# EAGLE design 14145 (EAGLE 7.6.0)
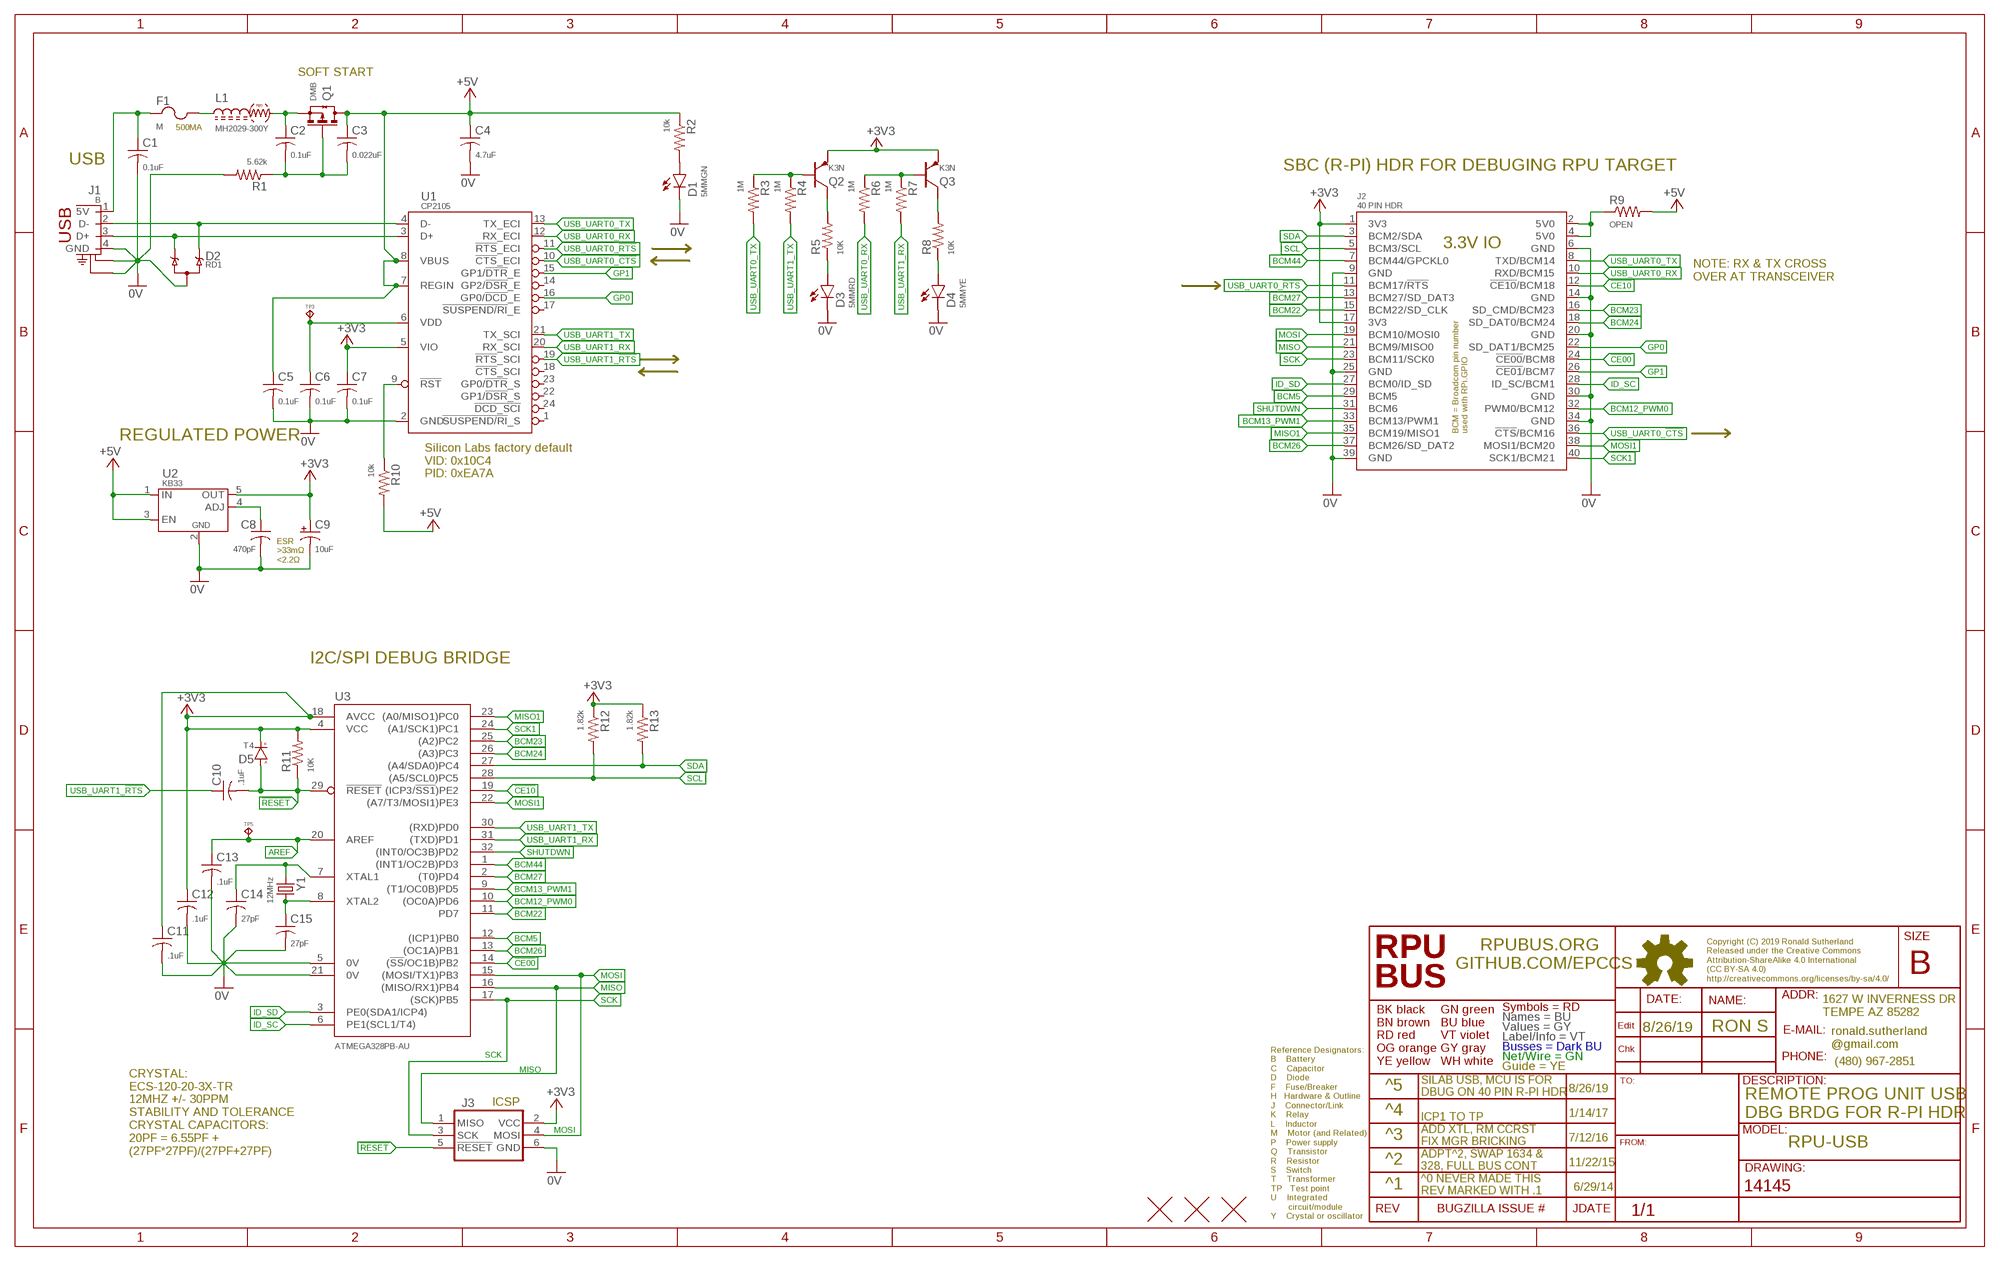
[diagram p0: schematic, sheet 1]

## Parts
C1  0.1uF  CC0603A  [C0603(1608)]
C2  0.1uF  CC0603A  [C0603(1608)]
C3  0.022uF  CC0603A  [C0603(1608)]
C4  4.7uF  CC1206  [C1206(3216)]
C5  0.1uF  CC0603A  [C0603(1608)]
C6  0.1uF  CC0603A  [C0603(1608)]
C7  0.1uF  CC0603A  [C0603(1608)]
C8  470pF  CC0603A  [C0603(1608)]
C9  10uF  CT1206  [3216]
C10  .1uF  CC0603A  [C0603(1608)]
C11  .1uF  CC0603A  [C0603(1608)]
C12  .1uF  CC0603A  [C0603(1608)]
C13  .1uF  CC0603A  [C0603(1608)]
C14  27pF  CC0603A  [C0603(1608)]
C15  27pF  CC0603A  [C0603(1608)]
D1  5MMGN  LED5MM  [LED5MM]
D2  RD1  TVS-2UNI  [SOT23]
D3  5MMRD  LED5MM  [LED5MM]
D4  5MMYE  LED5MM  [LED5MM]
D5  T4  DSOD123  [SOD123]
F1  M  SMD1210  [C1210(3225)]
J1  B  [USB-B-PTH]
J2  40 PIN HDR  RPI-ZERO  [RASPI_ZERO_H40PIN]
J3  ISP-SPIPTH  [ISP]
L1  MH2029-300Y  L0805  [C0805(2012)]
Q1  DMB  N-CHSOT23  [SOT23]
Q2  K3N  PNPSOT23  [SOT23]
Q3  K3N  PNPSOT23  [SOT23]
R1  5.62k  R0805  [C0805(2012)]
R2  10k  R0805  [C0805(2012)]
R3  1M  R0805  [C0805(2012)]
R4  1M  R0805  [C0805(2012)]
R5  10K  R0805  [C0805(2012)]
R6  1M  R0805  [C0805(2012)]
R7  1M  R0805  [C0805(2012)]
R8  10K  R0805  [C0805(2012)]
R9  OPEN  R0805  [C0805(2012)]
R10  10k  R0805  [C0805(2012)]
R11  10K  R0805  [C0805(2012)]
R12  1.82k  R0805  [C0805(2012)]
R13  1.82k  R0805  [C0805(2012)]
TP3  TPPAD1-08  [P1-08]
TP5  TPPAD1-08  [P1-08]
U1  CP2105  [QFN24]
U2  KB33  MIC5205  [SOT23-5,SOT25]
U3  ATMEGA328PB-AU  [TQFP32-08]
U$2  FIDUCIAL1.27  [FIDUCIAL-1.27]
U$3  FIDUCIAL1.27  [FIDUCIAL-1.27]
U$4  FIDUCIAL1.27  [FIDUCIAL-1.27]
Y1  12MHz  CSM-3X  [CSM-3X]

## Nets
0V: C1.2 C4.2 C5.2 C6.2 C7.2 C8.2 C9.- C11.2 C12.2 C13.2 C14.2 C15.2 D1.K D2.3(A) D3.K D4.K J1.4(GND) J1.S1(CHASSIS1) J1.S2(CHASSIS2) J2.6(GND) J2.9(GND) J2.14(GND) J2.20(GND) J2.25(GND) J2.30(GND) J2.34(GND) J2.39(GND) J3.6(GND) R1.2 U1.2(GND) U2.2(GND) U3.5(0V) U3.21(0V)
5V0@2: J2.2(5V0) J2.4(5V0) R9.1
!CE00!: J2.24(!CE00!/BCM8) U3.14((!SS!/OC1B)PB2)
!CE10!: J2.12(!CE10!/BCM18) U3.19((ICP3/!SS1!)PE2)
!RESET: C10.2 D5.A J3.5(!RESET) R11.1 U3.29(!RESET)
+3V3: C7.1 C9.+ C11.1 C12.1 D5.C(K) J2.1(3V3) J2.17(3V3) J3.2(VCC) Q2.E Q3.E R11.2 R12.1 R13.1 U1.5(VIO) U2.5(OUT) U3.4(VCC) U3.18(AVCC)
+5V: C3.1 C4.1 C5.1 Q1.3(D)(D) R2.1 R9.2 R10.2 U1.7(REGIN) U1.8(VBUS) U2.1(IN) U2.3(EN)
AREF: C13.1 TP5.TP U3.20(AREF)
BCM5: J2.29(BCM5) U3.12((ICP1)PB0)
BCM12_PWM0: J2.32(PWM0/BCM12) U3.10((OC0A)PD6)
BCM13_PWM1: J2.33(BCM13/PWM1) U3.9((T1/OC0B)PD5)
BCM22: J2.15(BCM22/SD_CLK) U3.11(PD7)
BCM23: J2.16(SD_CMD/BCM23) U3.25((A2)PC2)
BCM24: J2.18(SD_DAT0/BCM24) U3.26((A3)PC3)
BCM26: J2.37(BCM26/SD_DAT2) U3.13((OC1A)PB1)
BCM27: J2.13(BCM27/SD_DAT3) U3.2((T0)PD4)
BCM44: J2.7(BCM44/GPCKL0) U3.1((INT1/OC2B)PD3)
D+: D2.1(C1) J1.3(D+) U1.3(D+)
D-: D2.2(C2) J1.2(D-) U1.4(D-)
FTDI3V3: C6.1 TP3.TP U1.6(VDD)
GP0: J2.22(SD_DAT1/BCM25) U1.16(GP0/!DCD!_E)
GP1: J2.26(!CE01!/BCM7) U1.15(GP1/!DTR!_E)
ID_SC: J2.28(ID_SC/BCM1) U3.6(PE1(SCL1/T4))
ID_SD: J2.27(BCM0/ID_SD) U3.3(PE0(SDA1/ICP4))
MISO: J2.21(BCM9/MISO0) J3.1(MISO) U3.16((MISO/RX1)PB4)
MISO1: J2.35(BCM19/MISO1) U3.23((A0/MISO1)PC0)
MOSI: J2.19(BCM10/MOSI0) J3.4(MOSI) U3.15((MOSI/TX1)PB3)
MOSI1: J2.38(MOSI1/BCM20) U3.22((A7/T3/MOSI1)PE3)
N$1: D1.A R2.2
N$2: D4.A R8.1
N$3: Q3.C R8.2
N$4: C1.1 F1.1 J1.1(5V)
N$5: F1.2 L1.1
N$6: D3.A R5.1
N$7: R10.1 U1.9(!RST!)
N$8: Q2.C R5.2
N$9: Q2.B R3.1 R4.1
N$17: Q3.B R6.1 R7.1
N$24: C8.1 U2.4(ADJ)
N$26: C2.1 L1.2 Q1.2(S)(S)
N$27: C2.2 C3.2 Q1.1(G)(G) R1.1
SCK: J2.23(BCM11/SCK0) J3.3(SCK) U3.17((SCK)PB5)
SCK1: J2.40(SCK1/BCM21) U3.24((A1/SCK1)PC1)
SCL: J2.5(BCM3/SCL) R12.2 U3.28((A5/SCL0)PC5)
SDA: J2.3(BCM2/SDA) R13.2 U3.27((A4/SDA0)PC4)
SHUTDWN: J2.31(BCM6) U3.32((INT0/OC3B)PD2)
USB_UART0_!CTS: J2.36(!CTS!/BCM16) U1.10(!CTS!_ECI)
USB_UART0_!RTS: J2.11(BCM17/!RTS!) U1.11(!RTS!_ECI)
USB_UART0_RX: J2.10(RXD/BCM15) R6.2 U1.12(RX_ECI)
USB_UART0_TX: J2.8(TXD/BCM14) R3.2 U1.13(TX_ECI)
USB_UART1_!RTS: C10.1 U1.19(!RTS!_SCI)
USB_UART1_RX: R7.2 U1.20(RX_SCI) U3.31((TXD)PD1)
USB_UART1_TX: R4.2 U1.21(TX_SCI) U3.30((RXD)PD0)
XTAL1: C14.1 U3.7(XTAL1) Y1.1
XTAL2: C15.1 U3.8(XTAL2) Y1.2
Unconnected: U1.1(!SUSPEND/RI!_S) U1.14(GP2/!DSR!_E) U1.17(!SUSPEND/RI!_E) U1.18(!CTS!_SCI) U1.22(GP1/!DSR!_S) U1.23(GP0/!DTR!_S) U1.24(!DCD_SCI!)

## Notes on the sheet
- SOFT START
- 500MA
- USB
- SBC (R-PI) HDR FOR DEBUGING RPU TARGET
- NOTE: RX & TX CROSS
  OVER AT TRANSCEIVER
- REGULATED POWER
- Silicon Labs factory default
  VID: 0x10C4
  PID: 0xEA7A
- ESR
  >33mΩ
  <2.2Ω
- I2C/SPI DEBUG BRIDGE
- 8/26/19 | RON S
- ^5 | 8/26/19
- SILAB USB, MCU IS FOR
  DBUG ON 40 PIN R-PI HDR
- ICSP
- ^4 | 1/14/17
- REMOTE PROG UNIT USB 
  DBG BRDG FOR R-PI HDR
- ICP1 TO TP
- ^3 | 7/12/16
- ADD XTL, RM CCRST
  FIX MGR BRICKING
- RPU-USB
- CRYSTAL:
  ECS-120-20-3X-TR 
  12MHZ +/- 30PPM
  STABILITY AND TOLERANCE
  CRYSTAL CAPACITORS:
  20PF = 6.55PF +
  (27PF*27PF)/(27PF+27PF)
- ^2 | 11/22/15
- ADPT^2, SWAP 1634 &
  328, FULL BUS CONT
- ^1 | 6/29/14
- ^0 NEVER MADE THIS
  REV MARKED WITH .1

## Library data of the parts
C1-C8 C10-C15 = C-C:C: CAPACITOR Symbol
C9 = C-T:CT: Tantalum Electrolytic Capacitor
D1 D3 D4 = D-LED:LED: LED 120120WH [CREE,XHGAWT-00-0000-00000HXE1] LED WHITE 6500K 150LUM-W120120
D2 = D-TVS:TVS-2UNI: 2 Unidirectional Channels e.g., DESDA5V3L [DIODES@DESDA5V3L-7] TVS DIODE 3V 15V SOT23 MARK: RD1
D5 = D-GP:D: DIODE
F1 = F-RST:SMD: Fuse i.e. Bourns, MF-USMF075-2
J1 = J-USB:B: B [MOLEX,0670688000] USB B THROUGH HOLE
J2 = U-Pi:RPI-ZERO: Raspberry Pi Zero https://pinout.xyz/ NOTE: WiFi is needed see https://www.kickstarter.com/projects/1991736672/iot-hat-for-raspberry-pi-a-must-have-for-pi-zero
J3 = U-AVR:ISP-SPI: AVR ISP thru SPI In-System Programming uses the target Atmel AVR’s internal SPI (Serial Peripheral Interface) to download code into the flash and EEPROM memories. It is not a debugging interface. When designing an application PCB which includes an AVR with the SPI interface, this pinout should be used. Sparkfun SKU: BOB-08508
L1 = L-FB:L: Ferrite Bead with frequency dependent resistance
Q1 = Q-PCH:N-CH?*: ENHANCEMENT MODE MOSFET SOT23 is BSS138 pinout
Q2 Q3 = Q-PNP:PNP: BJT NPN General Purpose Amplifier
R1-R13 = R-C:R: Resiistor American-style symbol
TP3 TP5 = J-TP:TP: Test pad
U1 = U-Transceiver:CP2105: CP2105 SILABS@CP2105-F01-GMR TRANSCEIVER USB DUAL UART 24QFN
U2 = P-DCDC:MIC5205: KB33 [MICREL,MIC5205-3.3YM5] REG ULDO 3V3 150MA SOT23-5
U3 = U-AVR:ATMEGA328PB-AU: ATmega328PB 4 Kbytes FLASH 128 bytes SRAM 256 bytes EEPROM 2 UART, 2 I2C, 2 SPI 8-channel 10 bit ADC
U$2-U$4 = H-Fiducial:FIDUCIAL: Fiducial Alignment Points Various fiducial points for machine vision alignment.
Y1 = Y-XTL:CSM: 16MHZ20 [ECS,ECS-160-20-3X-TR] CRYSTAL 16MHZ 20PF 30PPM CSM-3X

## Net classes
0 default: width 0.178 mm, drill 0.33 mm

## Board
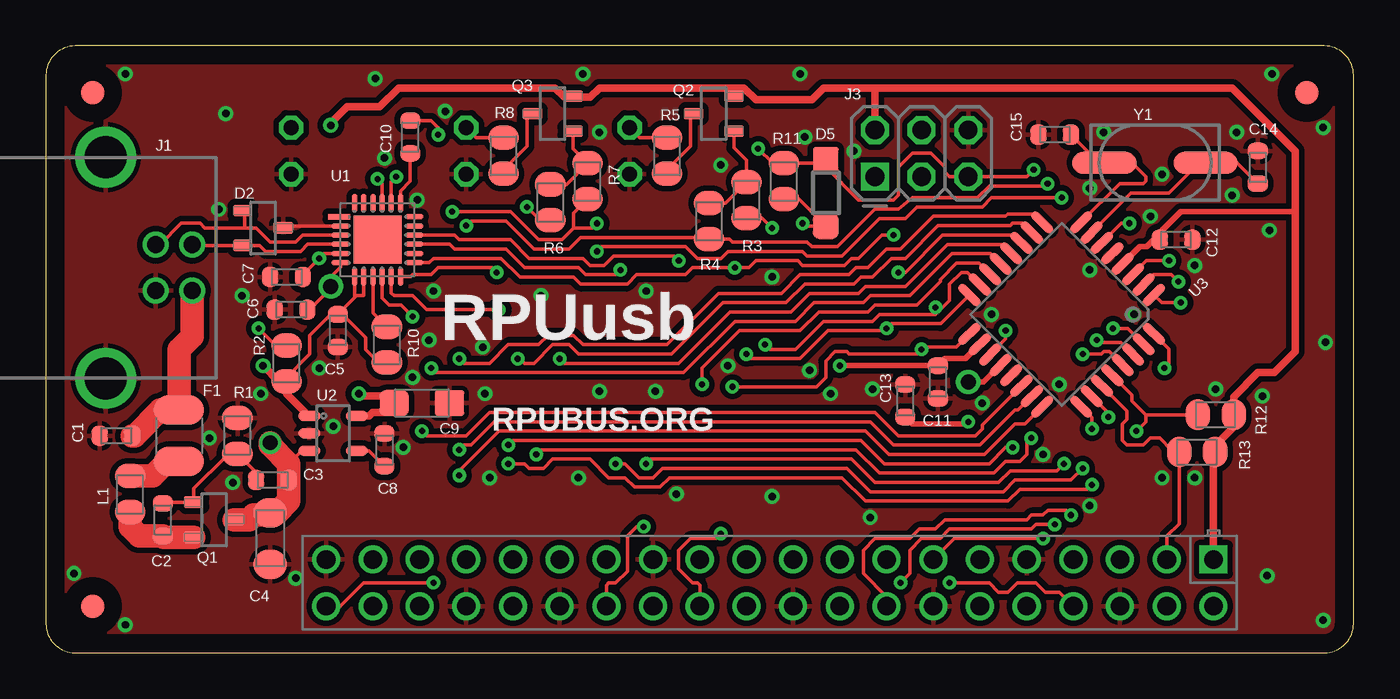
[diagram p1: board, top side]
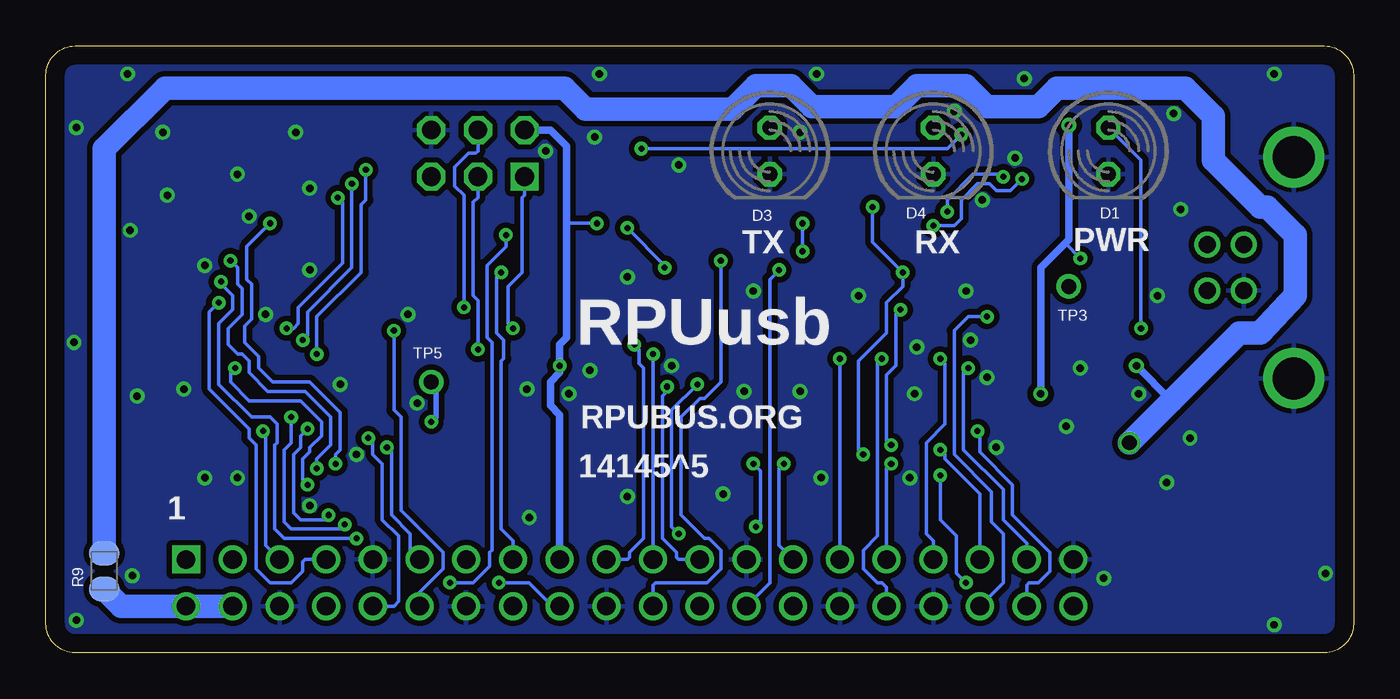
[diagram p2: board, bottom side, seen from below]

Size 71.12 x 33.02 mm. Coordinates in mm from the lower left corner, seen from the top.
Outline: 0,31.43 0,1.59 arc90 1.59,0 69.53,0 arc90 71.12,1.59 71.12,31.43 arc90 69.53,33.02 1.59,33.02 arc90 0,31.43
Copper layers (1*16): Top 0.034290625mm / dielectric 60mil / Bottom 0.034290625mm
Design rules "default *": minimum track width 8mil, minimum drill 13mil, track to track 8mil, track to pad 8mil, pad to pad 7mil, via to via 8mil, smd to smd 7mil, copper to edge 40mil, drill to drill 12mil, minimum pad ring 10mil, minimum via ring 8mil, stop-mask expansion 4mil, vias tented up to drill 17mil, thermal gap 10mil

### Footprints (pad centres in the part's own frame; a part is rotated, then mirrored left to right if it is on the bottom)
C0603(1608) = smd 0.898 x 1.1: 1 -0.889,0; 2 0.889,0
C1206(3216) = smd 1.6 x 1.8: 1 -1.4,0; 2 1.4,0
3216 = smd 1.6 x 1.4: + -1.5,0; - 1.5,0
LED5MM = drill 0.813 octagon: A -1.27,0; K 1.27,0
SOT23 = smd 0.65 x 1.06: 1 -0.95,-1.1; 2 0.95,-1.1; 3 0,1.1
SOD123 = smd 1.4 x 1.4: A 1.8,0; C -1.8,0
C1210(3225) = smd 1.6 x 2.7: 1 -1.4,0; 2 1.4,0
USB-B-PTH = drill 0.914: 1 1.981,-1.25; 2 1.981,1.25; 3 0,1.25; 4 0,-1.25 | drill 2.286: S1 -2.718,-6.02; S2 -2.718,6.02
RASPI_ZERO_H40PIN = drill 1.016 square: 1 0,0 | drill 1.016: 2 0,2.54; 3 2.54,0; 4 2.54,2.54; 5 5.08,0; 6 5.08,2.54; 7 7.62,0; 8 7.62,2.54; 9 10.16,0; 10 10.16,2.54; 11 12.7,0; 12 12.7,2.54; 13 15.24,0; 14 15.24,2.54; 15 17.78,0; 16 17.78,2.54; 17 20.32,0; 18 20.32,2.54; 19 22.86,0; 20 22.86,2.54; 21 25.4,0; 22 25.4,2.54; 23 27.94,0; 24 27.94,2.54; 25 30.48,0; 26 30.48,2.54; 27 33.02,0; 28 33.02,2.54; 29 35.56,0; 30 35.56,2.54; 31 38.1,0; 32 38.1,2.54; 33 40.64,0; 34 40.64,2.54; 35 43.18,0; 36 43.18,2.54; 37 45.72,0; 38 45.72,2.54; 39 48.26,0; 40 48.26,2.54
ISP = drill 1.016 square: 1 0,0 | drill 1.016 octagon: 2 0,2.54; 3 2.54,0; 4 2.54,2.54; 5 5.08,0; 6 5.08,2.54
C0805(2012) = smd 1.321 x 1.651: 1 -0.977,0; 2 0.977,0
SOT23' = smd 0.65 x 1.06: 1(G) -0.95,-1.1; 2(S) 0.95,-1.1; 3(D) 0,1.1
SOT23'' = smd 0.65 x 1.06: B -0.95,-1.1; C 0,1.1; E 0.95,-1.1
P1-08 = drill 0.813: TP 0,0
QFN24 = smd 1.2 x 0.3: 1 -2.1,1.25 | smd 1 x 0.3: 2 -2,0.75; 3 -2,0.25; 4 -2,-0.25; 5 -2,-0.75; 6 -2,-1.25; 13 2,-1.25; 14 2,-0.75; 15 2,-0.25; 16 2,0.25; 17 2,0.75; 18 2,1.25 | smd 0.3 x 1: 7 -1.25,-2; 8 -0.75,-2; 9 -0.25,-2; 10 0.25,-2; 11 0.75,-2; 12 1.25,-2; 19 1.25,2; 20 0.75,2; 21 0.25,2; 22 -0.25,2; 23 -0.75,2; 24 -1.25,2 | smd 2.6 x 2.6: EXP 0,0
SOT23-5,SOT25 = smd 0.55 x 1.2: 1 -0.95,-1.3; 2 0,-1.3; 3 0.95,-1.3; 4 0.95,1.3; 5 -0.95,1.3
TQFP32-08 = smd 1.5 x 0.45: 1 -4.293,2.8; 2 -4.293,2; 3 -4.293,1.2; 4 -4.293,0.4; 5 -4.293,-0.4; 6 -4.293,-1.2; 7 -4.293,-2; 8 -4.293,-2.8; 17 4.293,-2.8; 18 4.293,-2; 19 4.293,-1.2; 20 4.293,-0.4; 21 4.293,0.4; 22 4.293,1.2; 23 4.293,2; 24 4.293,2.8 | smd 0.45 x 1.5: 9 -2.8,-4.293; 10 -2,-4.293; 11 -1.2,-4.293; 12 -0.4,-4.293; 13 0.4,-4.293; 14 1.2,-4.293; 15 2,-4.293; 16 2.8,-4.293; 25 2.8,4.293; 26 2,4.293; 27 1.2,4.293; 28 0.4,4.293; 29 -0.4,4.293; 30 -1.2,4.293; 31 -2,4.293; 32 -2.8,4.293
FIDUCIAL-1.27 = smd 1.27 x 1.27: 1 0,0
CSM-3X = smd 3.5 x 1.2: 1 -2.75,0; 2 2.75,0

### Placement (x,y rotation side)
C1  3.81,11.81 180 top
C2  6.35,7.24 90 top
C3  12.32,9.4 180 top
C4  12.19,6.22 270 top
C5  15.88,17.53 270 top
C6  13.34,18.67 180 top
C7  13.08,20.45 180 top
C8  18.41,11.05 90 top
C9  20.45,13.59 0 top
C10  19.81,28.07 90 top
C11  48.51,14.73 270 top
C12  61.47,22.48 0 top
C13  46.74,13.72 90 top
C14  65.91,26.42 90 top
C15  54.86,28.19 180 top
D1  13.34,27.3 270 bottom
D2  11.81,23.11 270 top
D3  31.75,27.3 270 bottom
D4  22.86,27.3 270 bottom
D5  42.42,25.02 90 top
F1  7.24,11.81 270 top
J1  5.97,20.95 0 top
J2  63.5,5.08 180 top
J3  45.09,25.91 0 top
L1  4.57,8.64 270 top
Q1  DMB  [SOT23']  9.14,7.24 270 top
Q2  K3N  [SOT23'']  36.32,29.34 90 top
Q3  K3N  [SOT23'']  27.56,29.34 90 top
R1  10.41,11.81 90 top
R2  13.08,15.75 90 top
R3  38.1,24.64 270 top
R4  36.07,23.5 270 top
R5  33.78,27.05 270 top
R6  27.43,24.51 270 top
R7  29.46,25.65 270 top
R8  24.89,27.05 270 top
R9  67.94,4.45 90 bottom
R10  18.54,16.76 270 top
R11  40.13,25.65 270 top
R12  63.63,12.95 180 top
R13  62.61,10.92 180 top
TP3  15.49,19.94 180 bottom
TP5  50.16,14.73 0 bottom
U1  18.03,22.48 0 top
U2  15.62,11.94 270 top
U3  55.24,18.41 225 top
U$2  68.58,30.48 0 top
U$3  2.54,30.48 0 top
U$4  2.54,2.54 0 top
Y1  60.33,26.67 180 top

### Tracks (layer width: path | path; a pad name or v marks a point on that pad's centre or on a via)
0V  (via drill 0.41)
  Top 0.203: U1.2 13.03,23.23 D2.3
  other vias: 15.62,12.32 11.68,14.1 10.16,9.27 1.52,4.32 4.32,1.52 13.59,4.06 66.55,22.99 64.52,24.89 60.07,23.75 20.19,24.64 56.77,20.83 56.77,25.27 57.53,28.32 64.77,28.32 60.71,26.04 62.48,21.08 63.63,14.35 66.17,13.97 66.67,31.5 69.47,28.57 69.6,16.89 69.47,1.78 41.02,31.5 29.21,31.5 17.91,31.24 21.72,29.46 30.1,28.32 36.7,26.54 41.27,28.07 43.94,27.3 37.08,15.62 44.96,14.35 50.93,13.59 55.12,14.61 51.44,18.41 59.18,18.41 60.71,9.53 62.48,9.53 66.42,4.19 4.32,31.5 9.4,24.13 9.78,29.34 18.41,26.92 21.08,19.68 20.83,17.02 14.86,15.49 10.67,19.43 8.89,11.68 39.5,20.45 32.64,19.68 26.92,19.43 23.75,16.64 23.88,14.1 30.1,14.22 33.15,14.22 24.13,9.53 28.96,9.53 34.29,8.64 39.5,8.51 41.53,15.37 44.83,7.37 56.77,8 54.23,10.79 19.43,11.18 19.94,14.99 42.67,14.1
  pour Top (isolate 0.305): 71.12,0 0,0 0,33.02 71.12,33.02
  pour Bottom (isolate 0.305): 0,33.02 71.12,33.02 71.12,0 0,0
5V0@2
  Bottom 1.27: J2.4 J2.2 67.02,2.54 R9.1
!CE00!  (via drill 0.33)
  Top 0.203: U3.14 50.75,21.21 49.53,21.21 48.64,20.32 48.64,20.19 47.37,18.92 45.09,18.92 44.7,18.54 42.04,18.54 41.02,17.53 37.72,17.53 35.69,15.49 v35.69,14.61 | v36.7,6.48 36.45,6.22 35.05,6.22 34.42,5.59 34.42,4.57 35.18,3.81 35.43,3.81 35.56,3.68 J2.24
  Bottom 0.203: v35.69,14.61 37.08,13.21 37.08,6.86 v36.7,6.48
!CE10!  (via drill 0.33)
  Top 0.203: U3.19 52.2,17.06 v52.2,17.53
  Bottom 0.203: v52.2,17.53 52.2,13.21 51.82,12.83 51.82,7.75 49.53,5.46 49.53,4.57 50.8,3.3 J2.12
!RESET  (via drill 0.33)
  Top 0.203: v38.73,27.43 39.54,26.63 R11.1 42.23,26.63 D5.A 42.42,26.42 44.2,24.64 46.1,24.64 46.35,24.89 46.35,26.42 47.12,27.18 48.13,27.18 48.9,26.42 48.9,26.16 49.15,25.91 J3.5 53.34,25.91 v53.72,26.29 | v21.34,28.19 21.34,28.57 20.95,28.96 C10.2 | U3.29 57.84,16.38 57.53,16.38 57.4,16.26 v56.39,16.26
  Bottom 0.203: v38.73,27.43 22.1,27.43 v21.34,28.19 | v56.39,16.26 56.39,18.29 53.98,20.7 53.98,24.38 53.72,24.64 v53.72,26.29
+3V3  (via drill 0.33, 0.41)
  Top 0.203: U1.5 15.12,21.73 v14.86,21.46 14.1,20.7 C7.1 | C12.1 60.71,22.61 | R11.2 40.96,24.68 D5.C 41.3,23.22 v41.15,23.37 | Q2.E 37.42,30.31 37.85,30.73 | Q3.E 28.66,30.18 28.83,30.23
  Top 0.305: U3.4 59.49,22.1 59.88,22.1 60.26,22.48 C12.1 | 60.71,22.61 60.71,22.99 61.72,24 67.94,24 | v43.18,15.62 C11.1 48.9,16 50,16 U3.18
  Top 0.406: J2.1 63.5,10.83 R13.1 63.59,11.26 64.6,12.28 R12.1 64.6,13.93 65.91,15.24 66.8,15.24 67.94,16.38 67.94,24 67.94,27.3 64.52,30.73 45.09,30.73 | 45.09,30.73 42.29,30.73 41.66,30.1 38.61,30.1 37.97,30.73 37.85,30.73 30.1,30.73 29.59,30.23 28.83,30.23 28.19,30.23 27.69,30.73 19.18,30.73 18.16,29.72 16.38,29.72 15.49,28.83 v15.49,28.7 | v17.02,14.1 17.14,13.97 18.44,13.97 C9.+ 18.57,13.08 17.78,13.08 17.59,12.89 U2.5 | J3.2 45.09,30.73
  Bottom 0.203: v14.86,21.46 15.68,22.29 | v41.15,23.37 42.8,23.37
  Bottom 0.406: v15.49,28.7 15.49,22.48 15.68,22.29 17.02,20.95 v17.02,14.1 | J2.17 43.18,12.95 43.69,13.46 43.69,14.73 43.18,15.24 v43.18,15.62 43.18,16.76 42.8,17.14 42.8,23.37 42.8,27.56 43.69,28.45 J3.2
+5V  (via drill 0.41, 0.8)
  Top 0.203: U2.3 13.91,10.99 13.21,10.29 | R2.1 13.08,14.99 14.35,16.26 14.35,17.27 15.49,18.41 C5.1 | R10.2 18.16,15.75 17.4,16.51 17.4,17.14 16.13,18.41 C5.1 | U1.7 16.78,19.32 | 16.78,19.32 C5.1 | U1.8 17.28,19.44 17.27,19.43 16.89,19.43 16.78,19.32
  Top 0.406: v11.81,15.62 12.66,14.77 R2.1 13.08,14.1 14.29,12.89 U2.1
  Top 1.27: Q1.3(D) 11.05,7.24 11.3,7.49 12.06,7.49 C4.1 12.58,7.62 13.21,8.26 C3.1 13.21,10.29 12.19,11.3 v12.19,11.43
  Bottom 0.406: v11.81,15.62 9.91,13.72
  Bottom 1.27: R9.2 67.94,27.43 64.64,30.73 52.2,30.73 42.93,30.73 41.78,29.59 33.78,29.59 32.51,30.86 30.61,30.86 29.46,29.72 24.89,29.72 23.75,30.86 21.08,30.86 19.94,29.72 17.14,29.72 16.13,30.73 9.14,30.73 7.62,29.21 7.62,26.8 5.08,24.26 4.7,24.26 3.17,22.73 3.17,19.43 5.08,17.4 6.22,17.4 9.91,13.72 v12.19,11.43
AREF  (via drill 0.33)
  Top 0.305: U3.20 51,14.73 TP5.TP | v50.16,12.57 50.04,12.45 47.12,12.45 C13.1
  Bottom 0.305: TP5.TP 49.91,14.48 49.91,12.83 v50.16,12.57
BCM5  (via drill 0.33)
  Top 0.203: U3.12 52,22.23 49.02,22.23 46.74,19.94 44.58,19.94 44.2,19.56 41.53,19.56 40.51,18.54 37.21,18.54 34.42,15.75 28.19,15.75 v27.94,16
  Bottom 0.203: v27.94,16 J2.29
BCM12_PWM0  (via drill 0.33)
  Top 0.203: U3.10 53.12,23.37 52.58,23.37 52.45,23.24 48.51,23.24 46.74,21.46 45.97,21.46 44.96,20.45 44.32,20.45 43.94,20.07 41.27,20.07 40.26,19.05 36.83,19.05 34.04,16.26 28.96,16.26 28.45,16.76 27.56,16.76 26.54,15.75 26.04,15.75 25.78,16 v25.65,16
  Bottom 0.203: v25.65,16 25.91,15.75 25.91,6.35 26.67,5.59 26.67,4.57 25.91,3.81 25.65,3.81 25.4,3.56 J2.32
BCM13_PWM1  (via drill 0.33)
  Top 0.203: U3.9 53.74,23.88 52.32,23.88 52.2,23.75 48.26,23.75 46.48,21.97 45.72,21.97 44.7,20.95 44.07,20.95 43.69,20.57 41.02,20.57 40.01,19.56 36.58,19.56 33.78,16.76 29.21,16.76 28.7,17.27 27.3,17.27 26.8,16.76 25.15,16.76 24.13,15.75 22.73,15.75 v22.48,16
  Bottom 0.203: v22.48,16 22.23,15.75 22.23,12.45 23.24,11.43 23.24,6.48 22.86,6.1 J2.33
BCM22  (via drill 0.33)
  Top 0.203: U3.11 52.62,22.73 48.77,22.73 46.74,20.7 v46.35,20.7
  Bottom 0.203: J2.15 45.72,6.1 46.35,6.73 46.35,15.88 46.23,16 46.23,17.02 46.61,17.4 46.61,20.45 v46.35,20.7
BCM23  (via drill 0.33)
  Top 0.203: U3.25 56.9,12.8 v56.9,12.19 | v55.75,7.49 55.5,7.75 54.48,7.75 54.23,7.49 53.59,7.49 53.34,7.24 48.9,7.24 48.39,6.73 47.5,6.73 46.99,6.22 45.09,6.22 44.45,5.59 44.45,4.32 45.72,3.05 J2.16
  Bottom 0.203: v56.9,12.19 57.28,11.81 57.28,11.18 57.66,10.79 57.66,7.62 57.28,7.24 55.88,7.24 55.75,7.37 v55.75,7.49
BCM24  (via drill 0.33)
  Top 0.203: U3.26 57.78,13.05 v57.78,12.83 | v54.86,6.99 53.85,6.99 53.59,6.73 49.15,6.73 48.64,6.22 47.62,6.22 46.99,5.59 46.99,4.32 v46.48,3.81
  Bottom 0.203: v57.78,12.83 57.78,11.43 58.17,11.05 58.17,7.11 57.78,6.73 55.12,6.73 v54.86,6.99 | v46.48,3.81 44.83,3.81 43.56,2.54 J2.18
BCM26  (via drill 0.33)
  Top 0.203: U3.13 51.38,21.72 49.28,21.72 46.99,19.43 44.83,19.43 44.45,19.05 41.78,19.05 40.77,18.03 37.47,18.03 34.67,15.24 21.21,15.24 v20.95,15.49
  Bottom 0.203: v20.95,15.49 21.21,15.24 21.21,11.05 19.05,8.89 19.05,7.24 17.78,5.97 J2.37
BCM27  (via drill 0.33)
  Top 0.203: U3.2 60.23,20.57 61.21,20.57 v61.59,20.19 | v54.23,6.22 49.4,6.22 J2.13
  Bottom 0.203: v61.59,20.19 61.59,20.07 60.96,19.43 60.96,18.67 61.72,17.91 61.72,14.61 59.94,12.83 58.93,12.83 58.55,12.45 58.55,11.43 58.67,11.3 58.67,6.73 58.17,6.22 v54.23,6.22
BCM44  (via drill 0.33)
  Top 0.203: 61.47,19.05 v61.72,19.05 60.68,19.05 U3.1
  Bottom 0.203: J2.7 57.02,5.08 57.15,4.95 57.15,4.45 57.78,3.81 58.93,3.81 59.69,4.57 59.69,11.3 60.07,11.68 60.07,12.19 62.23,14.35 62.23,18.54 v61.72,19.05
D+
  Top 0.203: U1.3 13.97,22.73 13.59,22.35 12.19,22.35 11.43,23.11 10.79,23.11 | 10.79,23.11 10.79,23.98 D2.1 | J1.3 6.2,22.2 7.37,23.37 8.38,23.37 8.64,23.11 10.79,23.11
D-
  Top 0.203: U1.4 14.23,22.23 13.84,21.84 11.94,21.84 11.62,22.16 D2.2 7.99,22.16 J1.2
FTDI3V3
  Top 0.203: C6.1 14.35,18.67 15.49,19.81 TP3.TP 15.49,20.45 16.03,20.99 U1.6
GP0  (via drill 0.33)
  Top 0.203: U1.16 22.23,22.73 22.48,22.48 25.27,22.48 26.29,21.46 29.21,21.46 29.59,21.08 30.35,21.08 30.86,21.59 34.16,21.59 v34.42,21.34
  Bottom 0.203: v34.42,21.34 34.42,14.73 35.31,13.84 35.56,13.84 36.58,12.83 36.58,7.49 35.31,6.22 35.05,6.22 34.42,5.59 34.42,4.57 35.18,3.81 37.97,3.81 38.1,3.68 J2.22
GP1  (via drill 0.33)
  Top 0.203: U1.15 21.97,22.23 22.23,21.97 25.02,21.97 26.04,20.95 28.96,20.95 29.34,20.57 30.99,20.57 v31.24,20.83
  Bottom 0.203: v31.24,20.83 31.75,20.32 31.75,3.81 J2.26
ID_SC  (via drill 0.33)
  Top 0.203: U3.6 58.5,23.37 v58.93,23.37 | v55.37,10.29 54.99,9.91 52.45,9.91 51.82,9.27 45.09,9.27 43.81,10.54 32.89,10.54 v32.64,10.29 | v32.51,6.86 32.13,6.86 31.62,6.35 31.62,4.45 30.99,3.81 30.61,3.81 30.48,3.68 J2.28
  Bottom 0.203: v58.93,23.37 60.2,22.1 60.2,20.32 59.94,20.07 59.94,18.16 60.33,17.78 60.33,16.89 59.56,16.13 59.56,15.49 58.8,14.73 56.77,14.73 55.12,13.08 55.12,11.05 55.37,10.79 v55.37,10.29 | v32.64,10.29 32.26,9.91 32.26,7.11 v32.51,6.86
ID_SD  (via drill 0.33)
  Top 0.203: U3.3 59.86,21.34 v61.09,21.34 | v56.39,10.03 55.75,9.4 52.7,9.4 52.07,8.76 44.83,8.76 43.56,10.03 33.53,10.03 33.02,9.53 32.26,9.53 31.5,10.29 v30.99,10.29
  Bottom 0.203: v61.09,21.34 60.71,20.95 60.71,20.07 60.45,19.81 60.45,18.41 61.21,17.65 61.21,16.76 60.71,16.26 60.45,16.26 60.07,15.88 60.07,15.24 59.05,14.22 57.02,14.22 55.63,12.83 55.63,11.3 56.39,10.54 v56.39,10.03 | v30.99,10.29 31.24,10.03 31.24,5.84 J2.27
MISO  (via drill 0.33)
  Top 0.203: v38.1,16.26 38.35,16 41.02,16 42.55,17.53 45.59,17.53 v45.72,17.65 45.97,17.91 48.67,17.91 U3.16
  Bottom 0.203: v45.72,17.65 45.97,17.91 45.97,19.94 45.21,20.7 45.21,24.77 45.09,24.89 J3.1 | J2.21 v38.1,16.26
MISO1  (via drill 0.33)
  Top 0.203: U3.23 52.87,13.21 52.7,13.21 50.8,11.3 46.1,11.3 44.83,12.57 24.38,12.57 23.11,11.3 22.73,11.3 v22.48,11.05
  Bottom 0.203: v22.48,11.05 22.23,10.79 22.23,10.54 20.32,8.64 J2.35
MOSI  (via drill 0.33)
  Top 0.203: U3.15 50.13,20.7 49.78,20.7 49.15,20.07 49.15,19.18 48.64,18.67 | v39.12,16.76 39.37,16.51 40.77,16.51 42.29,18.03 44.96,18.03 45.34,18.41 48.39,18.41 48.64,18.67 | v48.39,18.8 48.51,18.67 48.64,18.67
  Bottom 0.203: v39.12,16.76 38.86,16.51 38.86,15.75 38.61,15.49 38.61,6.22 39.37,5.46 39.37,5.21 39.5,5.08 J2.19 | J3.4 47.62,27.3 47.75,27.18 48.13,27.18 48.9,26.42 48.9,25.4 48.39,24.89 v48.39,18.8
MOSI1  (via drill 0.33)
  Top 0.203: U3.22 50.93,12.4 50.93,12.19 50.55,11.81 46.35,11.81 45.09,13.08 24.13,13.08 22.86,11.81 20.7,11.81 v20.45,12.06
  Bottom 0.203: v20.45,12.06 20.32,11.94 20.32,10.92 18.54,9.14 18.54,7.49 16.51,5.46 16.51,4.45 17.14,3.81 17.65,3.81 17.78,3.68 J2.38
N$1  (via drill 0.33)
  Top 0.203: R2.2 12.48,16.73 v11.56,17.65
  Bottom 0.203: D1.A 11.56,26.8 v11.56,17.65
N$2
  Top 0.203: R8.1 23.41,28.03 D4.A
N$3
  Top 0.203: R8.2 24.89,26.29 26.16,27.56 26.16,29.04 Q3.C
N$4
  Top 1.27: J1.1 7.95,17.22 7.24,16.51 F1.1 6.23,13.21 4.83,11.81 C1.1
N$5
  Top 1.27: F1.2 6.6,10.41 5.8,9.61 L1.1
N$6
  Top 0.203: R5.1 32.3,28.03 D3.A
N$7
  Top 0.203: U1.9 17.78,18.5 R10.1
N$8
  Top 0.203: R5.2 33.78,26.29 35.05,27.56 35.05,29.17 Q2.C
N$9
  Top 0.203: R4.1 36.96,24.47 R3.1 38.1,26.8 37.42,27.48 Q2.B
N$17
  Top 0.203: Q3.B 28.66,27.44 R7.1 28.32,25.49 R6.1
N$24
  Top 0.203: U2.4 17.59,10.99 C8.1
N$26
  Top 1.27: L1.2 4.57,6.86 5.08,6.35 C2.1 6.41,6.29 Q1.2(S)
N$27
  Top 0.203: C2.2 6.41,8.19 Q1.1(G) 8.04,8.93 9.78,10.67 10.25,10.67 R1.1 11.43,9.82 C3.2
SCK  (via drill 0.33)
  Top 0.203: v37.34,14.48 41.91,14.48 42.42,14.99 42.42,15.88 42.93,16.38 43.56,16.38 43.69,16.26 47.37,16.26 v47.62,16.51 47.75,16.64 49.51,16.64 U3.17
  Bottom 0.203: v47.62,16.51 47.62,19.18 47.88,19.43 47.88,24.51 47.62,24.77 J3.3 | v37.34,14.48 37.34,14.22 37.59,13.97 37.59,6.22 36.83,5.46 36.83,5.21 36.7,5.08 J2.23
SCK1  (via drill 0.33)
  Top 0.203: U3.24 53.24,12.45 52.7,12.45 51.05,10.79 45.85,10.79 44.58,12.06 24.64,12.06 22.48,9.91 v22.48,9.65 | v21.08,3.81 17.27,3.81 16,2.54 J2.40
  Bottom 0.203: v22.48,9.65 22.48,7.24 21.59,6.35 21.59,4.32 v21.08,3.81
SCL  (via drill 0.33)
  Top 0.203: U3.28 59.05,14.04 59.05,13.72 59.82,12.95 | 59.82,12.95 R12.2 | 59.82,12.95 59.82,12.57 v59.31,12.06
  Bottom 0.203: J2.5 59.18,5.84 59.18,11.94 v59.31,12.06
SDA
  Top 0.203: U3.27 58.8,13.16 58.8,12.7 58.55,12.45 58.55,11.56 58.8,11.3 59.69,11.3 60.07,11.68 60.58,11.68 61.21,11.05 61.21,10.92 R13.2 61.63,7.02 60.96,6.35 J2.3
SHUTDWN  (via drill 0.33)
  Top 0.203: U3.32 61.09,16.53 61.09,15.75 v60.83,15.49 | v56.9,9.14 56.64,8.89 52.96,8.89 52.32,8.26 44.58,8.26 43.31,9.53 33.91,9.53 33.4,9.02 32,9.02 31.5,9.53 30.61,9.53 29.59,10.54 27.56,10.54 27.05,10.03 26.29,10.03 26.04,10.29 v25.15,10.29
  Bottom 0.203: v60.83,15.49 61.09,15.24 61.09,14.73 60.07,13.72 57.28,13.72 56.13,12.57 56.13,11.81 56.77,11.18 56.77,10.92 57.15,10.54 57.15,9.4 v56.9,9.14 | v25.15,10.29 25.4,10.03 J2.31
USB_UART0_!CTS  (via drill 0.33)
  Top 0.203: U1.10 18.28,19.31 18.67,18.92 19.3,18.92 v19.94,18.29
  Bottom 0.203: v19.94,18.29 20.95,18.29 21.72,17.53 21.72,10.79 19.68,8.76 19.68,7.11 19.05,6.48 19.05,3.81 J2.36
USB_UART0_!RTS  (via drill 0.33)
  Top 0.203: v24.64,18.67 20.7,18.67 19.94,19.43 18.92,19.43 18.78,19.57 U1.11 | v25.15,11.3 25.4,11.56 44.32,11.56 45.59,10.29 51.31,10.29 52.2,11.18 v52.58,11.18
  Bottom 0.203: v25.15,11.3 25.4,11.56 25.4,15.11 24.89,15.62 24.89,18.41 v24.64,18.67 | v52.58,11.18 52.32,10.92 52.32,7.49 51.31,6.48 51.31,5.59 J2.11
USB_UART0_RX  (via drill 0.33)
  Top 0.203: U1.12 19.84,20.48 19.94,20.57 20.95,20.57 21.34,20.95 24.26,20.95 v24.51,20.7 | v26.67,10.79 26.92,11.05 44.07,11.05 45.34,9.78 51.56,9.78 52.2,10.41 52.96,10.41 53.34,10.79 53.34,11.43 v53.59,11.68 | R6.2 26.89,23.53 v26.16,24.26
  Bottom 0.203: v26.67,10.79 26.92,11.05 26.92,15.88 25.4,17.4 25.4,19.05 24.51,19.94 v24.51,20.7 26.16,22.35 v26.16,24.26 | v53.59,11.68 53.34,11.43 53.34,10.79 52.83,10.29 52.83,7.24 51.94,6.35 51.94,2.79 52.2,2.54 J2.10
USB_UART0_TX  (via drill 0.33)
  Top 0.203: v39.5,23.11 38.95,23.66 R3.2 | v46.1,22.73 45.47,22.73 44.2,21.46 43.81,21.46 43.43,21.08 41.15,21.08 40.89,21.34 38.61,21.34 38.23,20.95 v37.47,20.95 35.18,20.95 34.8,20.57 32.13,20.57 31.62,20.07 29.08,20.07 28.7,20.45 25.78,20.45 24.77,21.46 21.08,21.46 20.85,21.23 U1.13 | v49.15,3.81 51.31,3.81 51.82,3.3 52.32,3.3 52.83,3.81 53.85,3.81 54.36,3.3 55.12,3.3 J2.8
  Bottom 0.203: v37.47,20.95 37.47,21.08 v39.5,23.11 | v46.1,22.73 46.1,22.1 47.12,21.08 47.12,17.14 46.86,16.89 46.86,5.59 46.99,5.46 46.99,4.7 47.88,3.81 v49.15,3.81
USB_UART1_!RTS
  Top 0.203: U1.19 19.28,25.13 19.81,25.65 C10.1
USB_UART1_RX  (via drill 0.33)
  Top 0.203: U1.20 18.78,25.64 v19.05,25.91 | v22.1,24 25.27,24 26.8,22.48 28.07,22.48 28.7,23.11 | 28.7,23.11 28.7,23.91 R7.2 | U3.31 58.84,17.65 v58.04,17.65 | v55.24,24.77 51.44,24.77 50.93,24.26 47.37,24.26 46.74,23.62 45.34,23.62 43.31,21.59 41.4,21.59 41.15,21.84 37.08,21.84 36.7,21.46 35.43,21.46 34.8,22.1 30.23,22.1 v29.97,21.84 | v29.97,23.37 29.72,23.11 28.7,23.11
  Bottom 0.203: v19.05,25.91 19.18,26.04 20.7,26.04 22.1,24.64 v22.1,24 | v58.04,17.65 57.66,17.65 57.4,17.91 57.4,18.8 54.99,21.21 54.99,24.51 v55.24,24.77 | v29.97,21.84 v29.97,23.37
USB_UART1_TX  (via drill 0.33)
  Top 0.203: U3.30 58.47,16.89 57.4,16.89 57.28,17.02 v57.15,17.02 | v54.48,25.53 54.36,25.4 51.31,25.4 50.67,24.77 47.12,24.77 46.35,24.13 45.09,24.13 43.05,22.1 41.66,22.1 41.4,22.35 37.34,22.35 37.17,22.52 R4.2 35.98,22.61 29.08,22.61 28.45,21.97 26.54,21.97 25.02,23.5 23.11,23.5 v22.86,23.24 | 18.28,25.53 18.29,25.53 | U1.21 18.28,25.53 | 18.28,25.53 v18.03,25.78
  Bottom 0.203: v57.15,17.02 56.9,17.27 56.9,18.54 54.48,20.95 v54.48,25.53 | v22.86,23.24 21.72,23.24 21.34,23.62 21.34,24.64 20.45,25.53 19.81,25.53 19.43,25.15 18.67,25.15 v18.03,25.78
XTAL1
  Top 0.203: U3.7 59.02,25.02 61.09,25.02 62.74,26.67 Y1.1 64.77,26.67 C14.1
XTAL2
  Top 0.203: C15.1 57.28,26.67 Y1.2 59.05,26.67 59.82,25.91 59.82,25.65 59.69,25.53 58.4,25.53 U3.8

### Text on the board
tPlace: RPUusb | RPUBUS.ORG
bPlace: PWR | RX | TX | RPUusb | RPUBUS.ORG | 14145^5 | 1